# Altium project VanAtta_Switch_TB.PrjPcb
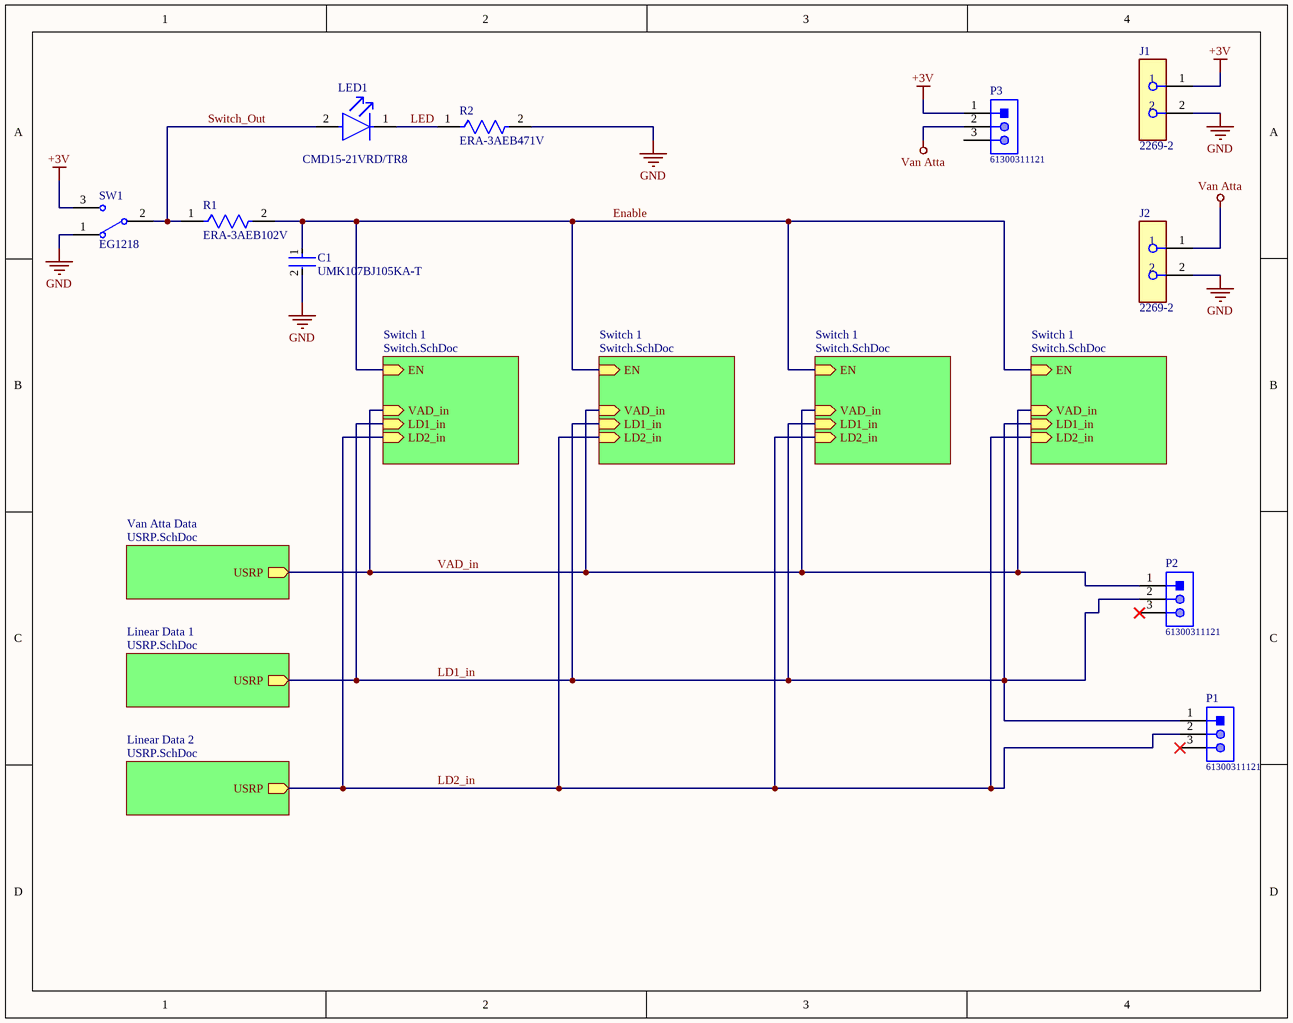
[diagram p0: Top sheet.SchDoc]
7 sheets, 128 parts. Net scope: hierarchical (ports join the sheet entries above them; power ports are global).
Board file: VanAtta_Switch_TB.PcbDoc
Sheets:
  Top sheet.SchDoc
    Switch 1 = Switch.SchDoc
      Van Atta Array = Van Atta array.SchDoc
      Signal Processing = Signal Processing.SchDoc
      Input and Relays = Inputs and Relays.SchDoc
      Linear Array = V2LinearArray.SchDoc
    Van Atta Data = USRP.SchDoc
    Linear Data 1 = USRP.SchDoc
    Linear Data 2 = USRP.SchDoc
    Switch 1 = Switch.SchDoc
      Van Atta Array = Van Atta array.SchDoc
      Signal Processing = Signal Processing.SchDoc
      Input and Relays = Inputs and Relays.SchDoc
      Linear Array = V2LinearArray.SchDoc
    Switch 1 = Switch.SchDoc
      Van Atta Array = Van Atta array.SchDoc
      Signal Processing = Signal Processing.SchDoc
      Input and Relays = Inputs and Relays.SchDoc
      Linear Array = V2LinearArray.SchDoc
    Switch 1 = Switch.SchDoc
      Van Atta Array = Van Atta array.SchDoc
      Signal Processing = Signal Processing.SchDoc
      Input and Relays = Inputs and Relays.SchDoc
      Linear Array = V2LinearArray.SchDoc

## Sheet Top sheet.SchDoc: Top Sheet
size A; DocumentNumber: 1; SheetNumber: 1; SheetTotal: 6; SPICEModelCachePVRFRYQE: <root> / <DocumentId>PVRFRYQE</DocumentId> / </root>

### Parts
C1  UMK107BJ105KA-T  [FP-0603-L_1_6_0_1-W_0_8_0-IPC_A]
J1  2269-2  [FP-2269-2-MFG]
J2  2269-2  [FP-2269-2-MFG]
LED1  CMD15-21VRD/TR8  [FP-CMD15-21-MFG]
P1  61300311121  [61300311121]
P2  61300311121  [61300311121]
P3  61300311121  [61300311121]
R1  ERA-3AEB102V  [FP-ERA3A-IPC_C]
R2  ERA-3AEB471V  [FP-ERA3A-IPC_A]
SW1  EG1218  [ESWI-EG1218_V]

### Sub-sheets
Linear Data 1 = USRP.SchDoc: USRP (out)
Linear Data 2 = USRP.SchDoc: USRP (out)
Switch 1 = Switch.SchDoc: EN (in), LD2_in (in), LD1_in (in), VAD_in (in)
Switch 1 = Switch.SchDoc: EN (in), LD2_in (in), LD1_in (in), VAD_in (in)
Switch 1 = Switch.SchDoc: EN (in), LD2_in (in), LD1_in (in), VAD_in (in)
Switch 1 = Switch.SchDoc: EN (in), LD2_in (in), LD1_in (in), VAD_in (in)
Van Atta Data = USRP.SchDoc: USRP (out)

### Nets
+3V: J1.1 P3.1 SW1.3
GND: C1.2 J1.2 J2.2 R2.2 SW1.1
Van Atta: J2.1 P3.2
Enable: C1.1 R1.2 ; sheet Switch 1/EN, sheet Switch 1/EN, sheet Switch 1/EN, sheet Switch 1/EN  [project net EN]
LD1_in: P1.1 P2.2 ; sheet Switch 1/LD1_in, sheet Linear Data 1/USRP, sheet Switch 1/LD1_in, sheet Switch 1/LD1_in, sheet Switch 1/LD1_in  [project net LD1]
LD2_in: P1.2 ; sheet Switch 1/LD2_in, sheet Linear Data 2/USRP, sheet Switch 1/LD2_in, sheet Switch 1/LD2_in, sheet Switch 1/LD2_in  [project net LD2]
LED: LED1.1(C) R2.1
Switch_Out: LED1.2(A) R1.1 SW1.2(COM)
VAD_in: P2.1 ; sheet Switch 1/VAD_in, sheet Van Atta Data/USRP, sheet Switch 1/VAD_in, sheet Switch 1/VAD_in, sheet Switch 1/VAD_in  [project net USRP]

Not connected (* = marked no-connect by the designer): P1 3*; P2 3*; P3 3

### Library data of the parts
C1 = CMP-2000-05447-3: None; Tolerance: 10%; Voltage Rating: 50V; Capacitance: 1uF; Dielectric: X5R; Height: 0.8mm; Depth: 0.8mm; Number of Pins: 2; Length: 1.6mm; Thickness: 0.035inch; Contact Plating: Nickel; Radiation Hardening: No; Package Quantity: 1; Case/Package: 0603; Halogen Free: Halogen Free; RoHS Compliant: Yes; Termination: SMD/SMT; Max Operating Temperature: 85°C; Min Operating Temperature: -55°C; Case Code (Metric): 1608; Construction: Flat; Voltage Rating (DC): 50V; Packaging: Tape and Reel; Series: M; Case Code (Imperial): 0603; Width: 0.031inch; Mount: Surface Mount
J1 J2 = CMP-73906-000010-1: CONN DBL BANANA JACK TURRET; Voltage Rating (DC): 70V; Max Current Rating: 15A; Number of Contacts: 2; Voltage Rating: 2.5kV; Body Material: PC; Gender: Female; Insulation: Mating End Insulated; Housing Color: Red; Insulation Material: Polycarbonate; Contact Material: Brass; Termination: Solder; Height: 0.375inch; Orientation: Straight; Lead Free: Lead Free; Length: 24inch; Depth: 16mm; Current Rating: 15A; Width: 4inch; Contact Plating: Tin; Weight: 0.033lb; RoHS Compliant: Yes; REACH SVHC: No SVHC; Package Quantity: 5; Number of Ports: 2; Color: Red; Housing Material: Polycarbonate; Packaging: Bulk; Mount: Panel
LED1 = CMP-53976-000002-1: LED RED DIFFUSED 1206 SMD; Manufacturer: VCC; Led Orientation: Top View; Peak Emmision Wavelength: 640nm; Forward Current: 20mA; Power Dissipation: 105mW; Luminous Intensity: 4mcd; Forward Voltage: 2V; Reverse Voltage: 5V; Lead Free: Yes; Device Class L1: Optoelectronics; Package: CMD15-21; Temperature Range High: +85°C; Digikey Description: LED RED DIFFUSED 1206 SMD; Mouser Description: Standard LEDs - SMD RED DIFFUSED; Height: 1.3mm; ComponentLink2Description: Datasheet; Manufacturer Part Number: CMD15-21VRD/TR8; ComponentLink2URL: https://www.vcclite.com/wp-content/uploads/wpallimport/files/files/CMD1521SeriesRev1.pdf; Temperature: -40°C to +85°C; Automotive: No; Octopart: https://octopart.com/cmd15-21vrd%2Ftr8-vcc-26668835; Temperature Range Low: -40°C; Device Class L3: unset; Colour: Red; Category: Diode; Device Class L2: LEDs; RoHS: TRUE
P1-P3 = CMP-1502-01062-1: THT Vertical Pin Header WR-PHD, Pitch 2.54 mm, Single Row, 3 pins; Manufacturer: Wurth Elektronik; Withstanding Voltage: 500VAC; Working Voltage: 250VAC; Rated Current: 3A; Pitch: 2.54mm; Pin Number: 3; Gender: Male; Contact Resistance: 20mOhm; Package Reference: 61300311121; Manufacturer URL: http://www.we-online.de; Datasheet URL: https://katalog.we-online.de/em/datasheet/6130xx11121.pdf; Operating Temperature: -40to105degC; Part Number: 61300311121; Orientation: Vertical; Packaging: Bag; Row Number: Single; Mounting Technology: THT; Publisher: WurthElektronik
R1 = CMP-2000-00873-2: RES SMD 1K OHM 0.1% 1/10W 0603; Temperature Coefficient: 25ppm/°C; Voltage Rating: 75V; Max Power Dissipation: 100mW; Resistance: 1kR; Technology: METAL FILM; Number of Pins: 2; Packaging: Tape and Reel; Case Code (Imperial): 0603; Case Code (Metric): 1608; Min Operating Temperature: -55°C; REACH SVHC: No SVHC; Length: 1.6mm; Termination: SMD/SMT; Depth: 0.8mm; Resistance Tolerance: 0.1%; Number of Terminations: 2; Width: 0.8mm; Military Standard: Not; Tolerance: 0.1%; Package Quantity: 5000; Contact Plating: Tin; Height: 0.45mm; Construction: Rectangular; Case/Package: 0603; Max Operating Temperature: 155°C; Resistor Type: Thin Film; Series: ERA-3A; Size Code: 0603; RoHS Compliant: Yes; Mount: Surface Mount; Radiation Hardening: No; Power Rating: 100mW
R2 = CMP-2000-00071-2: RES SMD 470 OHM 0.1% 1/10W 0603; Temperature Coefficient: 25ppm/°C; Power Rating: 100mW; Voltage Rating: 75V; Resistance: 470R; Mount: Surface Mount; Size Code: 0603; Contact Plating: Tin; Military Standard: Not; Resistor Type: Thin Film; Width: 0.8mm; Length: 1.6mm; Technology: THIN FILM; RoHS Compliant: Yes; Number of Terminations: 2; Series: ERA-3A; Number of Pins: 2; Construction: Rectangular; Radiation Hardening: No; Max Operating Temperature: 155°C; Termination: SMD/SMT; Case Code (Imperial): 0603; Case Code (Metric): 1608; Tolerance: 0.1%; Packaging: Tape and Reel; Depth: 0.8mm; REACH SVHC: No SVHC; Case/Package: 0603; Min Operating Temperature: -55°C; Lead Free: Lead Free; Package Quantity: 1; Resistance Tolerance: 0.1%; Voltage Rating (DC): 75V; Max Power Dissipation: 100mW; Features: Automotive AEC-Q200; Height: 0.45mm
SW1 = CMP-011-00006-2: Slide Switch, SPDT, 500 V, -20 to 70 degC, 3-Pin THD, RoHS, Bulk; Manufacturer: E-Switch; Voltage Rating (DC): 30V; Current Rating: 200mA; Operating Force: 250gf; Package Quantity: 1000; Contact Plating: Silver; Max Operating Temperature: 70°C; Min Operating Temperature: -20°C; Contact Material: Copper; Datasheet URL: https://www.e-switch.com/system/asset/product_line/data_sheet/119/EG.pdf; Contact Finish: Silver; Case/Package: EG1218; Voltage Rating (AC): 30V; Datasheet Version: Oct-15; Package Description: 3-Pin Through Hole Device, Body 11.6 x 4 mm, Pitch 2.5 mm; RoHS Compliant: True; Package Reference: EG1218; Manufacturer URL: http://www.e-switch.ch/en/; Throw Configuration: SPDT; Contact Current Rating: 200mA; Mounting Technology: TH; Packaging: Bulk; Pins: 3

## Sheet Switch.SchDoc
size A; DocumentNumber: 2; SheetNumber: 2; SheetTotal: 6; SPICEModelCacheIVTIOJWM: <root> / <DocumentId>IVTIOJWM</DocumentId> / </root>
Used 4 times, as channels Switch 1, Switch 1, Switch 1, Switch 1. Parts and nets are listed once, with the designators drawn on the sheet.
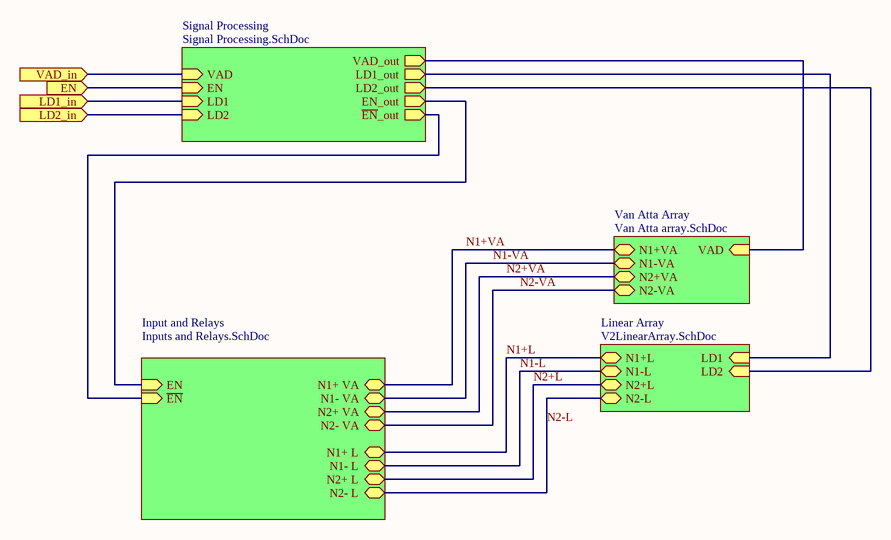
[diagram p1: Switch.SchDoc]

### Sub-sheets
Input and Relays = Inputs and Relays.SchDoc: N1- L (bidir), N2+ L (bidir), N1+ L (bidir), N2- VA (bidir), EN (in), ~{EN} (in), N1- VA (bidir), N1+ VA (bidir), N2- L (bidir), N2+ VA (bidir)
Linear Array = V2LinearArray.SchDoc: N1-L (bidir), N1+L (bidir), N2+L (bidir), N2-L (bidir), LD2 (in), LD1 (in)
Signal Processing = Signal Processing.SchDoc: EN (in), EN_out (out), ~{EN}_out (out), LD1 (in), LD1_out (out), LD2 (in), VAD (in), LD2_out (out), VAD_out (out)
Van Atta Array = Van Atta array.SchDoc: N2-VA (bidir), N1-VA (bidir), N1+VA (bidir), N2+VA (bidir), VAD (in)

### Ports
EN (in), LD1_in (in), LD2_in (in), VAD_in (in)

### Nets
EN: port EN, sheet Signal Processing/EN
LD1_in: port LD1_in, sheet Signal Processing/LD1
LD2_in: port LD2_in, sheet Signal Processing/LD2
N1+L: sheet Input and Relays/N1+ L, sheet Linear Array/N1+L
N1+VA: sheet Van Atta Array/N1+VA, sheet Input and Relays/N1+ VA
N1-L: sheet Input and Relays/N1- L, sheet Linear Array/N1-L
N1-VA: sheet Van Atta Array/N1-VA, sheet Input and Relays/N1- VA
N2+L: sheet Input and Relays/N2+ L, sheet Linear Array/N2+L
N2+VA: sheet Van Atta Array/N2+VA, sheet Input and Relays/N2+ VA
N2-L: sheet Input and Relays/N2- L, sheet Linear Array/N2-L
N2-VA: sheet Van Atta Array/N2-VA, sheet Input and Relays/N2- VA
VAD_in: port VAD_in, sheet Signal Processing/VAD
(unnamed): sheet Van Atta Array/VAD, sheet Signal Processing/VAD_out
(unnamed): sheet Signal Processing/EN_out, sheet Input and Relays/EN
(unnamed): sheet Signal Processing/~{EN}_out, sheet Input and Relays/~{EN}
(unnamed): sheet Signal Processing/LD1_out, sheet Linear Array/LD1
(unnamed): sheet Signal Processing/LD2_out, sheet Linear Array/LD2

### Channels
Switch 1: ports EN=EN LD1_in=LD1 LD2_in=LD2 VAD_in=USRP
Switch 1: ports EN=EN LD1_in=LD1 LD2_in=LD2 VAD_in=USRP
Switch 1: ports EN=EN LD1_in=LD1 LD2_in=LD2 VAD_in=USRP
Switch 1: ports EN=EN LD1_in=LD1 LD2_in=LD2 VAD_in=USRP

## Sheet Van Atta array.SchDoc
size A; DocumentNumber: 5; SheetNumber: 5; SheetTotal: 6
Used 4 times, as channels Switch 1/Van Atta Array, Switch 1/Van Atta Array, Switch 1/Van Atta Array, Switch 1/Van Atta Array. Parts and nets are listed once, with the designators drawn on the sheet.
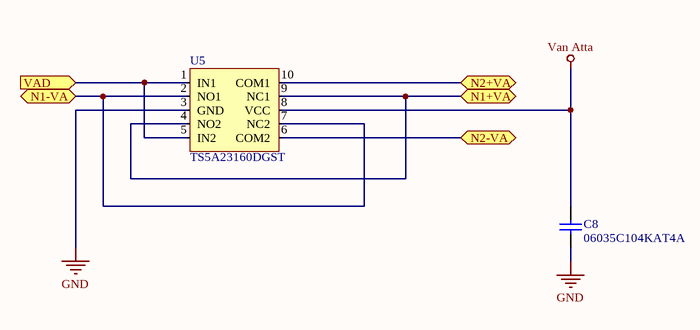
[diagram p2: Van Atta array.SchDoc]

### Parts
C8  06035C104KAT4A  [CAPC1608X90X35LL15T15]
U5  TS5A23160DGST  [TSSOP50P490X110-10N]

### Ports
N1+VA (bidir), N1-VA (bidir), N2+VA (bidir), N2-VA (bidir), VAD (in)

### Nets
GND: C8.2 U5.3(GND)
Van Atta: C8.1 U5.8(VCC)
N1+VA: U5.4(NO2) U5.9(NC1) ; port N1+VA
N1-VA: U5.2(NO1) U5.7(NC2) ; port N1-VA
N2+VA: U5.10(COM1) ; port N2+VA
N2-VA: U5.6(COM2) ; port N2-VA
VAD: U5.1(IN1) U5.5(IN2) ; port VAD

### Channels
Switch 1/Van Atta Array: designators end in .D; ports N1+VA=N1+VA_Switch 1 N1-VA=N1-VA_Switch 1 N2+VA=N2+VA_Switch 1 N2-VA=N2-VA_Switch 1 VAD=USRP
Switch 1/Van Atta Array: designators end in .C; ports N1+VA=N1+VA_Switch 1 N1-VA=N1-VA_Switch 1 N2+VA=N2+VA_Switch 1 N2-VA=N2-VA_Switch 1 VAD=USRP
Switch 1/Van Atta Array: designators end in .B; ports N1+VA=N1+VA_Switch 1 N1-VA=N1-VA_Switch 1 N2+VA=N2+VA_Switch 1 N2-VA=N2-VA_Switch 1 VAD=USRP
Switch 1/Van Atta Array: designators end in .A; ports N1+VA=N1+VA_Switch 1 N1-VA=N1-VA_Switch 1 N2+VA=N2+VA_Switch 1 N2-VA=N2-VA_Switch 1 VAD=USRP

### Library data of the parts
C8 = CMP-2006-04390-1: Manufacturer: AVX Interconnect / Elco; Part Number: 06035C104KAT4A
U5 = CMP-011-00013-3: 0.9-Ω on-state resistance, 5-V, 2: 1 (SPDT), 2-channel analog switch 10-VSSOP -40 to 85

## Sheet Signal Processing.SchDoc: Signal Processing
size A; DocumentNumber: 3; SheetNumber: 3; SheetTotal: 6
Used 4 times, as channels Switch 1/Signal Processing, Switch 1/Signal Processing, Switch 1/Signal Processing, Switch 1/Signal Processing. Parts and nets are listed once, with the designators drawn on the sheet.
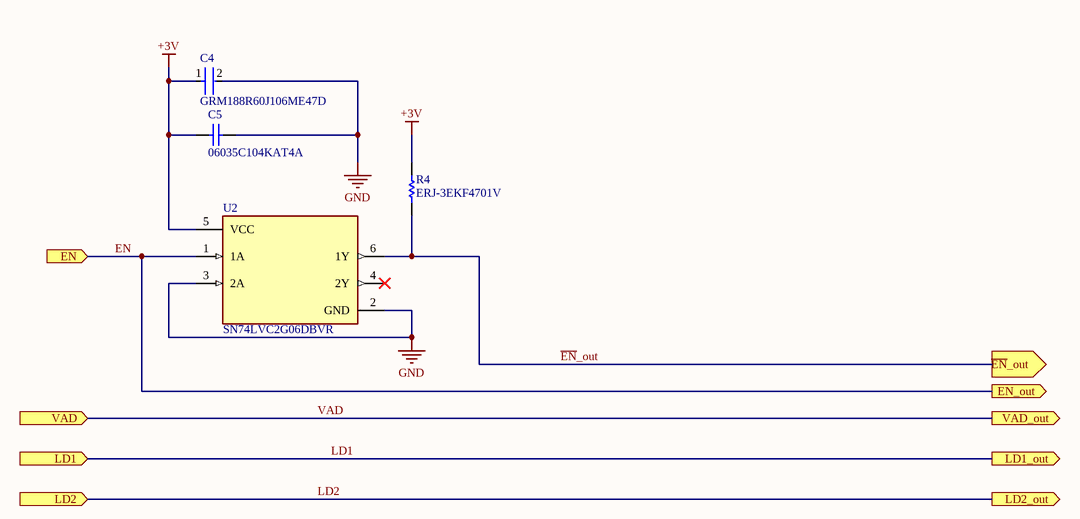
[diagram p3: Signal Processing.SchDoc]

### Parts
C4  GRM188R60J106ME47D  [FP-GRM188-0_1-e0_2_0_55-IPC_A]
C5  06035C104KAT4A  [CAPC1608X90X35LL15T15]
R4  ERJ-3EKF4701V  [RESC1608X55X30NL15T15]
U2  SN74LVC2G06DBVR  [FP-DBV0006A-IPC_A]

### Ports
EN (in), EN_out (out), LD1 (in), LD1_out (out), LD2 (in), LD2_out (out), VAD (in), VAD_out (out), ~{EN}_out (out)

### Nets
+3V: C4.1 C5.2 R4.2 U2.5(VCC)
GND: C4.2 C5.1 U2.2(GND) U2.3(2A)
~{EN}_out: R4.1 U2.6(1Y) ; port ~{EN}_out
EN: U2.1(1A) ; port EN, port EN_out
LD1: port LD1, port LD1_out
LD2: port LD2, port LD2_out
VAD: port VAD, port VAD_out

Not connected (* = marked no-connect by the designer): U2 4(2Y)*

### Channels
Switch 1/Signal Processing: designators end in .D; ports EN=EN EN_out=EN LD1=LD1 LD1_out=LD1 LD2=LD2 LD2_out=LD2 VAD=USRP VAD_out=USRP ~{EN}_out=~{EN}_out
Switch 1/Signal Processing: designators end in .C; ports EN=EN EN_out=EN LD1=LD1 LD1_out=LD1 LD2=LD2 LD2_out=LD2 VAD=USRP VAD_out=USRP ~{EN}_out=~{EN}_out
Switch 1/Signal Processing: designators end in .B; ports EN=EN EN_out=EN LD1=LD1 LD1_out=LD1 LD2=LD2 LD2_out=LD2 VAD=USRP VAD_out=USRP ~{EN}_out=~{EN}_out
Switch 1/Signal Processing: designators end in .A; ports EN=EN EN_out=EN LD1=LD1 LD1_out=LD1 LD2=LD2 LD2_out=LD2 VAD=USRP VAD_out=USRP ~{EN}_out=~{EN}_out

### Library data of the parts
C4 = CMP-2006-02792-2: Chip Multilayer Ceramic Capacitors for General Purpose, 0603, 10uF, X5R, 15%, 20%, 6.3V; Packaging: Tape and Reel; Voltage Rating (DC): 6.3V; Width: 0.031inch; Termination: SMD/SMT; Dielectric: X5R; Package Quantity: 4000; Voltage Rating: 6.3V; Capacitance: 10uF; Case/Package: 0603; Min Operating Temperature: -55°C; Voltage: 6.3V; Length: 1.6mm; Thickness: 0.035inch; Lead Free: Lead Free; Depth: 0.8mm; Case Code (Imperial): 0603; Max Operating Temperature: 85°C; Material: Ceramic; Height: 0.8mm; Tolerance: 20%; Mount: Surface Mount; REACH SVHC: No SVHC; Radiation Hardening: No; Case Code (Metric): 1608
C5 = CMP-2006-04390-1: Manufacturer: AVX Interconnect / Elco; Part Number: 06035C104KAT4A
R4 = CMP-1012-00586-3: Precision Thick Film Chip Resistor, 4.7 KOhm, +/- 1%, -55 to 155 degC, 0603 (1608 Metric), RoHS, Tape and Reel; Resistance: 220 Ohm; Voltage Rating: 50 V; Elements: 4; Case\Package: 1205; Tolerance: 5%; Power Rating: 250 mW; PackageReference: 0603; Max Operating Temperature: 125 degC; REACH SVHC: No SVHC; Width: 0.063 inch; Length: 0.126 inch; Height: 0.024 inch; Mount: Surface Mount; Package Quantity: 1; DatasheetVersion: Apr-15; ComponentLink1Description: Manufacturer URL; Min Operating Temperature: -55 degC; Packaging: Tape and Reel; Radiation Hardening: No; ComponentLink2URL: http://industrial.panasonic.com/cdbs/www-data/pdf/RDA0000/AOA0000C86.pdf; Case Code (Metric): 3216; Pins: 8; Case Code (Imperial): 1206; Type (Resistor): Thick Film; RoHSCompliant: true; ComponentLink2Description: Datasheet; PackageDescription: 2-Pin Surface Mount Device, Body 1.6 x 0.85 mm; ComponentLink1URL: http://www.panasonic.com/
U2 = CMP-0859-00187-4: IC INVERTER 2CH 2-INP SOT23-6; Number of Channels: 2; Propagation Delay: 2.9ns; Min Supply Voltage: 1.65V; Polarity: Inverting; High Level Output Current: 32mA; Logic Function: Buffer; Max Supply Voltage: 5.5V; Nominal Supply Current: 40mA; Turn-On Delay Time: 7.2ns; Quiescent Current: 10uA; Number of Inputs: 1; Height: 1.15mm; Radiation Hardening: No; Length: 2.9mm; Number of Output Lines: 2; Package Quantity: 3000; Min Operating Temperature: -40°C; Case/Package: SOT-23; REACH SVHC: No SVHC; Number of Elements: 2; Number of Pins: 6; Mount: Surface Mount; Contact Plating: Gold; Number of Input Lines: 2; Number of Outputs: 2; Number of Circuits: 2; Number of Gates: 2; Max Operating Temperature: 125°C; RoHS Compliant: Yes; Low Level Output Current: 32mA; Number of Bits: 2; Width: 1.6mm; Packaging: Tape and Reel; Lead Free: Lead Free

## Sheet Inputs and Relays.SchDoc
size A; DocumentNumber: 4; SheetNumber: 4; SheetTotal: 6
Used 4 times, as channels Switch 1/Input and Relays, Switch 1/Input and Relays, Switch 1/Input and Relays, Switch 1/Input and Relays. Parts and nets are listed once, with the designators drawn on the sheet.
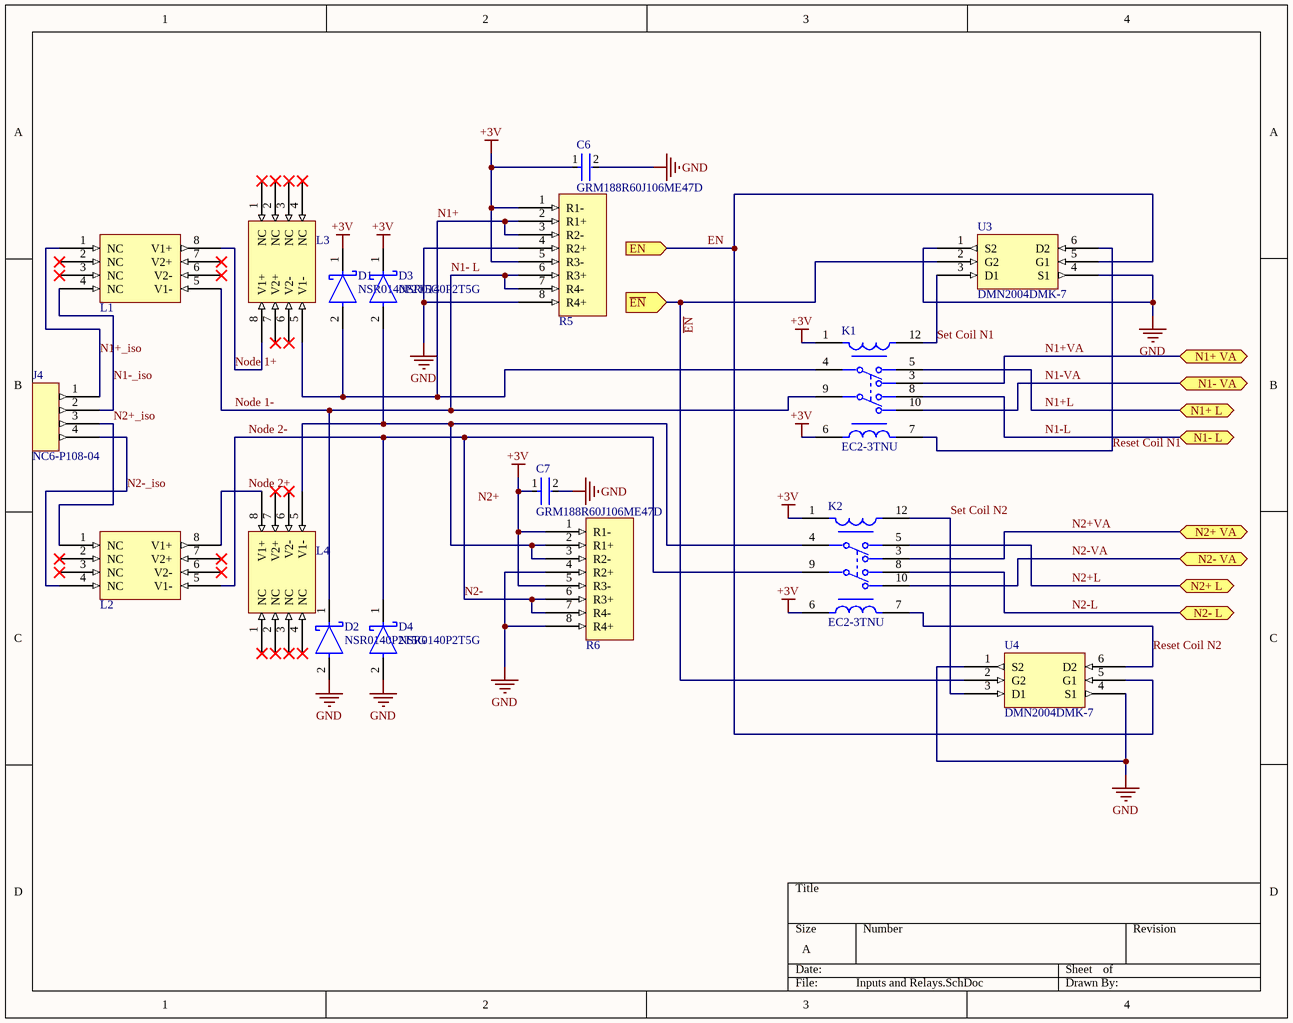
[diagram p4: Inputs and Relays.SchDoc]

### Parts
C6  GRM188R60J106ME47D  [FP-GRM188-0_1-e0_2_0_55-IPC_A]
C7  GRM188R60J106ME47D  [FP-GRM188-0_1-e0_2_0_55-IPC_A]
D1  NSR0140P2T5G  [FP-514AB-01-MFG]
D2  NSR0140P2T5G  [FP-514AB-01-MFG]
D3  NSR0140P2T5G  [FP-514AB-01-MFG]
D4  NSR0140P2T5G  [FP-514AB-01-MFG]
J4  NC6-P108-04  [NC6-P108-04-Footprint-1]
K1  EC2-3TNU  [FP-EC2-3TNU-MFG]
K2  EC2-3TNU  [FP-EC2-3TNU-MFG]
L1  RM6 Inductor  [RM6 Inductor-Footprint-1]  (value not drawn)
L2  RM6 Inductor  [RM6 Inductor-Footprint-1]  (value not drawn)
L3  RM6 Inductor  [RM6 Inductor-Footprint-1]  (value not drawn)
L4  RM6 Inductor  [RM6 Inductor-Footprint-1]  (value not drawn)
R5  4608X-102-205FLF  [4608X-102-205FLF-Footprint-1]  (value not drawn)
R6  4608X-102-205FLF  [4608X-102-205FLF-Footprint-1]  (value not drawn)
U3  DMN2004DMK-7  [SOT95P285X130-6N]
U4  DMN2004DMK-7  [SOT95P285X130-6N]

### Ports
EN (in), N1+ L (bidir), N1+ VA (bidir), N1- L (bidir), N1- VA (bidir), N2+ L (bidir), N2+ VA (bidir), N2- L (bidir), N2- VA (bidir), ~{EN} (in)

### Nets
+3V: C6.1 C7.1 D1.1(C) D3.1(C) K1.1(SET+) K1.6(RESET+) K2.1(SET+) K2.6(RESET+) R5.1(R1-) R5.5(R3-) R6.1(R1-) R6.5(R3-)
GND: C6.2 C7.2 D2.2(A) D4.2(A) R5.4(R2+) R5.8(R4+) R6.4(R2+) R6.8(R4+) U3.1(S2) U3.4(S1) U4.1(S2) U4.4(S1)
~{EN}: U3.2(G2) U4.2(G2) ; port ~{EN}
EN: U3.5(G1) U4.5(G1) ; port EN
N1+: D1.2(A) K1.4 L3.5(V1-) R5.2(R1+) R5.3(R2-)
N1+_iso: J4.1 L1.1(NC)
N1+L: K1.5 ; port N1+ L
N1+VA: K1.3 ; port N1+ VA
N1- L: D2.1(C) K1.9 L1.5(V1-) R5.6(R3+) R5.7(R4-)  [also labelled Node 1-]
N1-_iso: J4.2 L1.4(NC)
N1-L: K1.8 ; port N1- L
N1-VA: K1.10 ; port N1- VA
N2+_iso: J4.3 L2.1(NC)
N2+L: K2.5 ; port N2+ L
N2+VA: K2.3 ; port N2+ VA
N2-: D4.1(C) K2.9 L2.5(V1-) R6.6(R3+) R6.7(R4-)  [also labelled Node 2-]
N2-_iso: J4.4 L2.4(NC)
N2-L: K2.8 ; port N2- L
N2-VA: K2.10 ; port N2- VA
Node 1+: L1.8(V1+) L3.8(V1+)
Node 2+: L2.8(V1+) L4.8(V1+)
Reset Coil N1: K1.7(RESET-) U3.6(D2)
Reset Coil N2: K2.7(RESET-) U4.6(D2)
Set Coil N1: K1.12(SET-) U3.3(D1)
Set Coil N2: K2.12(SET-) U4.3(D1)
NetD3_2: D3.2(A) K2.4 L4.5(V1-) R6.2(R1+) R6.3(R2-)

Not connected (* = marked no-connect by the designer): L1 2(NC)* 3(NC)* 6(V2-)* 7(V2+)*; L2 2(NC)* 3(NC)* 6(V2-)* 7(V2+)*; L3 1(NC)* 2(NC)* 3(NC)* 4(NC)* 6(V2-)* 7(V2+)*; L4 1(NC)* 2(NC)* 3(NC)* 4(NC)* 6(V2-)* 7(V2+)*

### Channels
Switch 1/Input and Relays: designators end in .D; ports EN=EN N1+ L=N1+L_Switch 1 N1+ VA=N1+VA_Switch 1 N1- L=N1-L_Switch 1 N1- VA=N1-VA_Switch 1 N2+ L=N2+L_Switch 1 N2+ VA=N2+VA_Switch 1 N2- L=N2-L_Switch 1 N2- VA=N2-VA_Switch 1 ~{EN}=~{EN}_out
Switch 1/Input and Relays: designators end in .C; ports EN=EN N1+ L=N1+L_Switch 1 N1+ VA=N1+VA_Switch 1 N1- L=N1-L_Switch 1 N1- VA=N1-VA_Switch 1 N2+ L=N2+L_Switch 1 N2+ VA=N2+VA_Switch 1 N2- L=N2-L_Switch 1 N2- VA=N2-VA_Switch 1 ~{EN}=~{EN}_out
Switch 1/Input and Relays: designators end in .B; ports EN=EN N1+ L=N1+L_Switch 1 N1+ VA=N1+VA_Switch 1 N1- L=N1-L_Switch 1 N1- VA=N1-VA_Switch 1 N2+ L=N2+L_Switch 1 N2+ VA=N2+VA_Switch 1 N2- L=N2-L_Switch 1 N2- VA=N2-VA_Switch 1 ~{EN}=~{EN}_out
Switch 1/Input and Relays: designators end in .A; ports EN=EN N1+ L=N1+L_Switch 1 N1+ VA=N1+VA_Switch 1 N1- L=N1-L_Switch 1 N1- VA=N1-VA_Switch 1 N2+ L=N2+L_Switch 1 N2+ VA=N2+VA_Switch 1 N2- L=N2-L_Switch 1 N2- VA=N2-VA_Switch 1 ~{EN}=~{EN}_out

### Notes on the sheet
- Labels drawn without touching a wire or pin: N2+

### Library data of the parts
C6 C7 = CMP-2006-02792-2: as C4 on sheet Signal Processing; Packaging: Tape and Reel; Voltage Rating (DC): 6.3V; Width: 0.031inch; Termination: SMD/SMT; Dielectric: X5R; Package Quantity: 4000; Voltage Rating: 6.3V; Capacitance: 10uF; Case/Package: 0603; Min Operating Temperature: -55°C; Voltage: 6.3V; Length: 1.6mm; Thickness: 0.035inch; Lead Free: Lead Free; Depth: 0.8mm; Case Code (Imperial): 0603; Max Operating Temperature: 85°C; Material: Ceramic; Height: 0.8mm; Tolerance: 20%; Mount: Surface Mount; REACH SVHC: No SVHC; Radiation Hardening: No; Case Code (Metric): 1608
D1-D4 = CMP-1055-00493-2: DIODE SCHOTTKY 30V 70MA SOD923; Manufacturer: On Semiconductor; Max Surge Forward Current: 500mA; Capacitance: 2pF; Import Ts: 1521866362; Peak Reverse Current: 0.3uA; Ciiva Ids: 19354163; Max Repetitive Reverse Voltage: 40V; Max Junction Temp: +125°C; Value: 2pF; Automotive: No; ComponentLink2URL: http://www.onsemi.cn/pub_link/Collateral/NSR0140P2-D.PDF; Mouser Description: Schottky Diodes & Rectifiers SCHOTTKY DIODE; Height: 0.4mm; Temperature: -55°C to +125°C; Lead Free: Yes; Temperature Range Low: -55°C; Forward Current: 70mA; Device Class L2: Diodes; Reverse Voltage: 30V; Digikey Description: DIODE SCHOTTKY 30V 70MA SOD923; Temperature Range High: +125°C; Category: Diode; Octopart: https://octopart.com/nsr0140p2t5g-on+semiconductor-7506148; Device Class L1: Discrete Semiconductors; ComponentLink2Description: Datasheet; Package: 514AB-01; Device Class L3: Schottky Diodes; Release Date: 1407123163; Manufacturer Part Number: NSR0140P2T5G; RoHS: TRUE
J4 = CMP-002-00071-4: Conn Barrier Strip 4 POS 9.53mm Solder ST Thru-Hole 20A/Contact
K1 K2 = CMP-03195-000015-1: RELAY GEN PURPOSE DPDT 2A 3VDC; Relay Type: General Purpose; Release Time: 1ms; Number of Poles: 1; Power Consumption: 140mW; Coil Type: Latching, Dual Coil; Coil Resistance: 64.3R; Coil Voltage (DC): 3V; Coil Current: 46.7mA; Max Voltage Rating (AC): 250V; Max Voltage Rating (DC): 220V; Operate Time: 2ms; Throw Configuration: DPDT; Current Rating: 2A; Depth: 7.5mm; Contact Current Rating: 2A; Height: 9.4mm; Package Quantity: 35; Number of Pins: 10; Coil Power: 140mW; RoHS Compliant: Yes; Mount: Through Hole; Max Current Rating: 2A; Max Operating Temperature: 85°C; Contact Material: Gold; Radiation Hardening: No; Termination: PC Pin; Min Operating Temperature: -40°C; Length: 15mm; Packaging: Rail/Tube
L1-L4 = CMP-006-00021-1
R5 R6 = CMP-009-00178-1: Res Thick Film NET 2M Ohm 1% 1W ±100ppm/C ISOL Conformal Coated 8-Pin SIP Pin Thru-Hole Bulk
U3 U4 = CMP-013-00035-1: Transistor MOSFET Array Dual N-CH 20V 540mA 6-Pin SOT-26 T/R

## Sheet V2LinearArray.SchDoc
size A; DocumentNumber: 6; SheetNumber: 6; SheetTotal: 6
Used 4 times, as channels Switch 1/Linear Array, Switch 1/Linear Array, Switch 1/Linear Array, Switch 1/Linear Array. Parts and nets are listed once, with the designators drawn on the sheet.
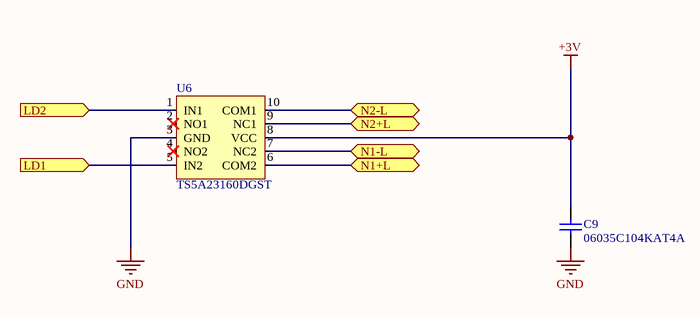
[diagram p5: V2LinearArray.SchDoc]

### Parts
C9  06035C104KAT4A  [CAPC1608X90X35LL15T15]
U6  TS5A23160DGST  [TSSOP50P490X110-10N]

### Ports
LD1 (in), LD2 (in), N1+L (bidir), N1-L (bidir), N2+L (bidir), N2-L (bidir)

### Nets
+3V: C9.1 U6.8(VCC)
GND: C9.2 U6.3(GND)
LD1: U6.5(IN2) ; port LD1
LD2: U6.1(IN1) ; port LD2
N1+L: U6.6(COM2) ; port N1+L
N1-L: U6.7(NC2) ; port N1-L
N2+L: U6.9(NC1) ; port N2+L
N2-L: U6.10(COM1) ; port N2-L

Not connected (* = marked no-connect by the designer): U6 2(NO1)* 4(NO2)*

### Channels
Switch 1/Linear Array: designators end in .D; ports LD1=LD1 LD2=LD2 N1+L=N1+L_Switch 1 N1-L=N1-L_Switch 1 N2+L=N2+L_Switch 1 N2-L=N2-L_Switch 1
Switch 1/Linear Array: designators end in .C; ports LD1=LD1 LD2=LD2 N1+L=N1+L_Switch 1 N1-L=N1-L_Switch 1 N2+L=N2+L_Switch 1 N2-L=N2-L_Switch 1
Switch 1/Linear Array: designators end in .B; ports LD1=LD1 LD2=LD2 N1+L=N1+L_Switch 1 N1-L=N1-L_Switch 1 N2+L=N2+L_Switch 1 N2-L=N2-L_Switch 1
Switch 1/Linear Array: designators end in .A; ports LD1=LD1 LD2=LD2 N1+L=N1+L_Switch 1 N1-L=N1-L_Switch 1 N2+L=N2+L_Switch 1 N2-L=N2-L_Switch 1

### Library data of the parts
C9 = CMP-2006-04390-1: Manufacturer: AVX Interconnect / Elco; Part Number: 06035C104KAT4A
U6 = CMP-011-00013-3: as U5 on sheet Van Atta array

## Sheet USRP.SchDoc
size A
Used 3 times, as channels Van Atta Data, Linear Data 1, Linear Data 2. Parts and nets are listed once, with the designators drawn on the sheet.
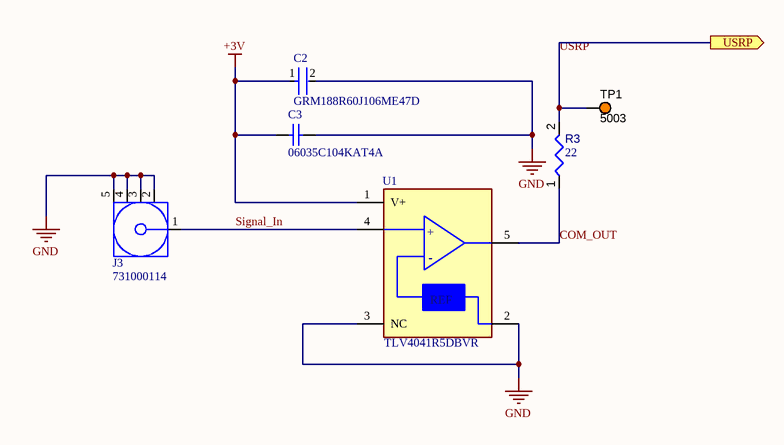
[diagram p6: USRP.SchDoc]

### Parts
C2  GRM188R60J106ME47D  [FP-GRM188-0_1-e0_2_0_55-IPC_A]
C3  06035C104KAT4A  [CAPC1608X90X35LL15T15]
J3  731000114  [MOLX-731000114_V]
R3  value 22  [RESC1609X50X30ML08T20]  (hidden comment: Resistor 22R +/-1% 0603 100 mW)
TP1  5003  [KSTN-5003]
U1  TLV4041R5DBVR  [FP-DBV0005A-IPC_C]

### Ports
USRP (out)

### Nets
+3V: C2.1 C3.2 U1.1(V+)
GND: C2.2 C3.1 J3.2 J3.3 J3.4 J3.5 U1.2(V-) U1.3(NC)
COM_OUT: R3.1 U1.5(OUT)
Signal_In: J3.1 U1.4(IN)
USRP: R3.2 TP1.1 ; port USRP

### Channels
Van Atta Data: designators end in _Van_Atta_Data; ports USRP=USRP
Linear Data 1: designators end in _Linear_Data_1; ports USRP=LD1
Linear Data 2: designators end in _Linear_Data_2; ports USRP=LD2

### Notes on the sheet
- (in symbol CMP-04896-000141-1) +; -; REF

### Library data of the parts
C2 = CMP-2006-02792-2: as C4 on sheet Signal Processing; Packaging: Tape and Reel; Voltage Rating (DC): 6.3V; Width: 0.031inch; Termination: SMD/SMT; Dielectric: X5R; Package Quantity: 4000; Voltage Rating: 6.3V; Capacitance: 10uF; Case/Package: 0603; Min Operating Temperature: -55°C; Voltage: 6.3V; Length: 1.6mm; Thickness: 0.035inch; Lead Free: Lead Free; Depth: 0.8mm; Case Code (Imperial): 0603; Max Operating Temperature: 85°C; Material: Ceramic; Height: 0.8mm; Tolerance: 20%; Mount: Surface Mount; REACH SVHC: No SVHC; Radiation Hardening: No; Case Code (Metric): 1608
C3 = CMP-2006-04390-1: Manufacturer: AVX Interconnect / Elco; Part Number: 06035C104KAT4A
J3 = CMP-2000-05487-1: SMA Right-Angle PCB Jack Receptacle, Brass Body, Gold Plated, 50 Ohm, 5-Pin THD, RoHS, Tray; Manufacturer: Molex; Datasheet Version: 09/2016; Package Description: 5-Pin Through Hole Device, Body 14.8 x 6.35 mm, Pitch 2.54 mm; Datasheet URL: http://www.molex.com/webdocs/datasheets/pdf/en-us/0731000114_RF_COAX_CONNECTORS.pdf; Manufacturer URL: http://www.molex.com/; Package Reference: 731000114; Mounting Technology: ThroughHole; Package URL: http://www.molex.com/pdm_docs/sd/731000114_sd.pdf
R3 = CMP-009-00027-5: Chip Resistor, 22 Ohm, +/- 1%, 100 mW, -55 to 155 degC, 0603 (1608 Metric); Power: 100mW; Voltage Rating: 75V; Max Operating Temperature: 155°C; Min Operating Temperature: -55°C; Tolerance: 1%; RoHS Compliant: True; Mounting Technology: SM; Case/Package: 0603; Pins: 2
TP1 = CMP-002-00037-2: Test Point, Orange, Height 4.6 mm, Tail Length 3 mm, 1-Pin THD, RoHS; Manufacturer: Keystone; Colour: Orange; Packaging: Bulk; Package Description: 1-Pin Through Hole Device, Dia 2.54 mm; Pins: 1; Package Reference: 5003; Datasheet Version: Jun-15; Case/Package: 5003; Mounting Technology: TH; Connector Type: TestPoint; Diameter: 2.54mm; Contact Material: Bronze; Datasheet URL: http://keyelco.com/userAssets/file/M65p56.pdf; Manufacturer URL: http://www.keyelco.com/; Package Quantity: 10; Contact Plating: Tin; RoHS Compliant: True
U1 = CMP-04896-000141-1: LOW-POWER COMPARATOR WITH REFERE

## Nets that join several sheets
+3V: Top sheet (J1.1 P3.1 SW1.3), Switch 1/Signal Processing (C4.D.1 C5.D.2 R4.D.2 U2.D.5), Switch 1/Input and Relays (12 pins), Switch 1/Linear Array (C9.D.1 U6.D.8), Van Atta Data (C2_Van_Atta_Data.1 C3_Van_Atta_Data.2 U1_Van_Atta_Data.1), Linear Data 1 (C2_Linear_Data_1.1 C3_Linear_Data_1.2 U1_Linear_Data_1.1), Linear Data 2 (C2_Linear_Data_2.1 C3_Linear_Data_2.2 U1_Linear_Data_2.1), Switch 1/Signal Processing (C4.C.1 C5.C.2 R4.C.2 U2.C.5), Switch 1/Input and Relays (12 pins), Switch 1/Linear Array (C9.C.1 U6.C.8), Switch 1/Signal Processing (C4.B.1 C5.B.2 R4.B.2 U2.B.5), Switch 1/Input and Relays (12 pins), Switch 1/Linear Array (C9.B.1 U6.B.8), Switch 1/Signal Processing (C4.A.1 C5.A.2 R4.A.2 U2.A.5), Switch 1/Input and Relays (12 pins), Switch 1/Linear Array (C9.A.1 U6.A.8)
GND: Top sheet (5 pins), Switch 1/Van Atta Array (C8.D.2 U5.D.3), Switch 1/Signal Processing (C4.D.2 C5.D.1 U2.D.2 U2.D.3), Switch 1/Input and Relays (12 pins), Switch 1/Linear Array (C9.D.2 U6.D.3), Van Atta Data (8 pins), Linear Data 1 (8 pins), Linear Data 2 (8 pins), Switch 1/Van Atta Array (C8.C.2 U5.C.3), Switch 1/Signal Processing (C4.C.2 C5.C.1 U2.C.2 U2.C.3), Switch 1/Input and Relays (12 pins), Switch 1/Linear Array (C9.C.2 U6.C.3), Switch 1/Van Atta Array (C8.B.2 U5.B.3), Switch 1/Signal Processing (C4.B.2 C5.B.1 U2.B.2 U2.B.3), Switch 1/Input and Relays (12 pins), Switch 1/Linear Array (C9.B.2 U6.B.3), Switch 1/Van Atta Array (C8.A.2 U5.A.3), Switch 1/Signal Processing (C4.A.2 C5.A.1 U2.A.2 U2.A.3), Switch 1/Input and Relays (12 pins), Switch 1/Linear Array (C9.A.2 U6.A.3)
Van Atta: Top sheet (J2.1 P3.2), Switch 1/Van Atta Array (C8.D.1 U5.D.8), Switch 1/Van Atta Array (C8.C.1 U5.C.8), Switch 1/Van Atta Array (C8.B.1 U5.B.8), Switch 1/Van Atta Array (C8.A.1 U5.A.8)
~{EN}_out: Switch 1/Signal Processing (R4.D.1 U2.D.6), Switch 1/Input and Relays (U3.D.2 U4.D.2)
~{EN}_out: Switch 1/Signal Processing (R4.C.1 U2.C.6), Switch 1/Input and Relays (U3.C.2 U4.C.2)
~{EN}_out: Switch 1/Signal Processing (R4.B.1 U2.B.6), Switch 1/Input and Relays (U3.B.2 U4.B.2)
~{EN}_out: Switch 1/Signal Processing (R4.A.1 U2.A.6), Switch 1/Input and Relays (U3.A.2 U4.A.2)
EN: Top sheet (C1.1 R1.2), Switch 1/Signal Processing (U2.D.1), Switch 1/Input and Relays (U3.D.5 U4.D.5), Switch 1/Signal Processing (U2.C.1), Switch 1/Input and Relays (U3.C.5 U4.C.5), Switch 1/Signal Processing (U2.B.1), Switch 1/Input and Relays (U3.B.5 U4.B.5), Switch 1/Signal Processing (U2.A.1), Switch 1/Input and Relays (U3.A.5 U4.A.5)
LD1: Top sheet (P1.1 P2.2), Switch 1/Linear Array (U6.D.5), Linear Data 1 (R3_Linear_Data_1.2 TP1_Linear_Data_1.1), Switch 1/Linear Array (U6.C.5), Switch 1/Linear Array (U6.B.5), Switch 1/Linear Array (U6.A.5)
LD2: Top sheet (P1.2), Switch 1/Linear Array (U6.D.1), Linear Data 2 (R3_Linear_Data_2.2 TP1_Linear_Data_2.1), Switch 1/Linear Array (U6.C.1), Switch 1/Linear Array (U6.B.1), Switch 1/Linear Array (U6.A.1)
N1+L_Switch 1: Switch 1/Input and Relays (K1.D.5), Switch 1/Linear Array (U6.D.6)
N1+L_Switch 1: Switch 1/Input and Relays (K1.C.5), Switch 1/Linear Array (U6.C.6)
N1+L_Switch 1: Switch 1/Input and Relays (K1.B.5), Switch 1/Linear Array (U6.B.6)
N1+L_Switch 1: Switch 1/Input and Relays (K1.A.5), Switch 1/Linear Array (U6.A.6)
N1+VA_Switch 1: Switch 1/Van Atta Array (U5.D.4 U5.D.9), Switch 1/Input and Relays (K1.D.3)
N1+VA_Switch 1: Switch 1/Van Atta Array (U5.C.4 U5.C.9), Switch 1/Input and Relays (K1.C.3)
N1+VA_Switch 1: Switch 1/Van Atta Array (U5.B.4 U5.B.9), Switch 1/Input and Relays (K1.B.3)
N1+VA_Switch 1: Switch 1/Van Atta Array (U5.A.4 U5.A.9), Switch 1/Input and Relays (K1.A.3)
N1-L_Switch 1: Switch 1/Input and Relays (K1.D.8), Switch 1/Linear Array (U6.D.7)
N1-L_Switch 1: Switch 1/Input and Relays (K1.C.8), Switch 1/Linear Array (U6.C.7)
N1-L_Switch 1: Switch 1/Input and Relays (K1.B.8), Switch 1/Linear Array (U6.B.7)
N1-L_Switch 1: Switch 1/Input and Relays (K1.A.8), Switch 1/Linear Array (U6.A.7)
N1-VA_Switch 1: Switch 1/Van Atta Array (U5.D.2 U5.D.7), Switch 1/Input and Relays (K1.D.10)
N1-VA_Switch 1: Switch 1/Van Atta Array (U5.C.2 U5.C.7), Switch 1/Input and Relays (K1.C.10)
N1-VA_Switch 1: Switch 1/Van Atta Array (U5.B.2 U5.B.7), Switch 1/Input and Relays (K1.B.10)
N1-VA_Switch 1: Switch 1/Van Atta Array (U5.A.2 U5.A.7), Switch 1/Input and Relays (K1.A.10)
N2+L_Switch 1: Switch 1/Input and Relays (K2.D.5), Switch 1/Linear Array (U6.D.9)
N2+L_Switch 1: Switch 1/Input and Relays (K2.C.5), Switch 1/Linear Array (U6.C.9)
N2+L_Switch 1: Switch 1/Input and Relays (K2.B.5), Switch 1/Linear Array (U6.B.9)
N2+L_Switch 1: Switch 1/Input and Relays (K2.A.5), Switch 1/Linear Array (U6.A.9)
N2+VA_Switch 1: Switch 1/Van Atta Array (U5.D.10), Switch 1/Input and Relays (K2.D.3)
N2+VA_Switch 1: Switch 1/Van Atta Array (U5.C.10), Switch 1/Input and Relays (K2.C.3)
N2+VA_Switch 1: Switch 1/Van Atta Array (U5.B.10), Switch 1/Input and Relays (K2.B.3)
N2+VA_Switch 1: Switch 1/Van Atta Array (U5.A.10), Switch 1/Input and Relays (K2.A.3)
N2-L_Switch 1: Switch 1/Input and Relays (K2.D.8), Switch 1/Linear Array (U6.D.10)
N2-L_Switch 1: Switch 1/Input and Relays (K2.C.8), Switch 1/Linear Array (U6.C.10)
N2-L_Switch 1: Switch 1/Input and Relays (K2.B.8), Switch 1/Linear Array (U6.B.10)
N2-L_Switch 1: Switch 1/Input and Relays (K2.A.8), Switch 1/Linear Array (U6.A.10)
N2-VA_Switch 1: Switch 1/Van Atta Array (U5.D.6), Switch 1/Input and Relays (K2.D.10)
N2-VA_Switch 1: Switch 1/Van Atta Array (U5.C.6), Switch 1/Input and Relays (K2.C.10)
N2-VA_Switch 1: Switch 1/Van Atta Array (U5.B.6), Switch 1/Input and Relays (K2.B.10)
N2-VA_Switch 1: Switch 1/Van Atta Array (U5.A.6), Switch 1/Input and Relays (K2.A.10)
USRP: Top sheet (P2.1), Switch 1/Van Atta Array (U5.D.1 U5.D.5), Van Atta Data (R3_Van_Atta_Data.2 TP1_Van_Atta_Data.1), Switch 1/Van Atta Array (U5.C.1 U5.C.5), Switch 1/Van Atta Array (U5.B.1 U5.B.5), Switch 1/Van Atta Array (U5.A.1 U5.A.5)